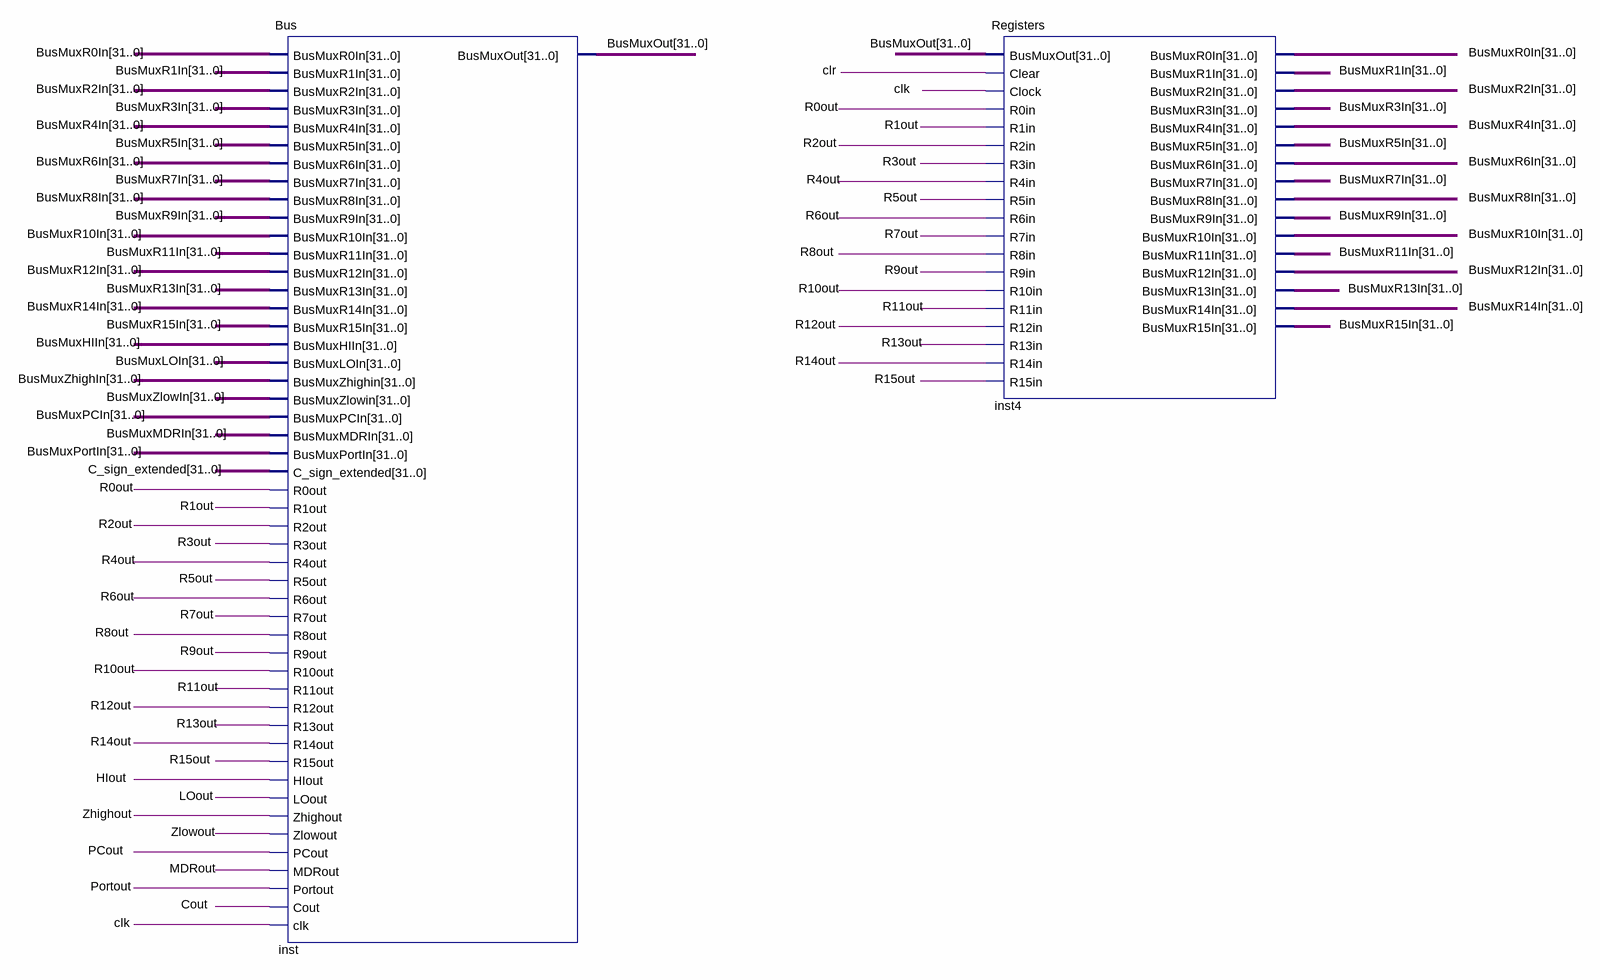
[diagram p0: schematic sheet]
// Quartus schematic CpuDesign.bdf as structural Verilog: 2 symbols, 0 pins
module CpuDesign (
);

  wire clk, clr, Cout, HIout, LOout, MDRout, PCout, Portout, R0out, R1out, R2out, R3out, R4out, R5out, R6out,
       R7out, R8out, R9out, R10out, R11out, R12out, R13out, R14out, R15out, Zhighout, Zlowout;
  wire [31:0] BusMuxHIIn, BusMuxLOIn, BusMuxMDRIn, BusMuxOut, BusMuxPCIn, BusMuxPortIn, BusMuxR0In,
       BusMuxR1In, BusMuxR2In, BusMuxR3In, BusMuxR4In, BusMuxR5In, BusMuxR6In, BusMuxR7In, BusMuxR8In,
       BusMuxR9In, BusMuxR10In, BusMuxR11In, BusMuxR12In, BusMuxR13In, BusMuxR14In, BusMuxR15In,
       BusMuxZhighIn, BusMuxZlowIn, C_sign_extended;

  Bus inst (
    .BusMuxR0In(BusMuxR0In), .BusMuxR1In(BusMuxR1In), .BusMuxR2In(BusMuxR2In), .BusMuxR3In(BusMuxR3In),
    .BusMuxR4In(BusMuxR4In), .BusMuxR5In(BusMuxR5In), .BusMuxR6In(BusMuxR6In), .BusMuxR7In(BusMuxR7In),
    .BusMuxR8In(BusMuxR8In), .BusMuxR9In(BusMuxR9In), .BusMuxR10In(BusMuxR10In), .BusMuxR11In(BusMuxR11In),
    .BusMuxR12In(BusMuxR12In), .BusMuxR13In(BusMuxR13In), .BusMuxR14In(BusMuxR14In),
    .BusMuxR15In(BusMuxR15In), .BusMuxHIIn(BusMuxHIIn), .BusMuxLOIn(BusMuxLOIn),
    .BusMuxZhighin(BusMuxZhighIn), .BusMuxZlowin(BusMuxZlowIn), .BusMuxPCIn(BusMuxPCIn),
    .BusMuxMDRIn(BusMuxMDRIn), .BusMuxPortIn(BusMuxPortIn), .C_sign_extended(C_sign_extended), .R0out(R0out),
    .R1out(R1out), .R2out(R2out), .R3out(R3out), .R4out(R4out), .R5out(R5out), .R6out(R6out), .R7out(R7out),
    .R8out(R8out), .R9out(R9out), .R10out(R10out), .R11out(R11out), .R12out(R12out), .R13out(R13out),
    .R14out(R14out), .R15out(R15out), .HIout(HIout), .LOout(LOout), .Zhighout(Zhighout), .Zlowout(Zlowout),
    .PCout(PCout), .MDRout(MDRout), .Portout(Portout), .Cout(Cout), .clk(clk), .BusMuxOut(BusMuxOut));
  Registers inst4 (
    .BusMuxOut(BusMuxOut), .Clear(clr), .Clock(clk), .R0in(R0out), .R1in(R1out), .R2in(R2out), .R3in(R3out),
    .R4in(R4out), .R5in(R5out), .R6in(R6out), .R7in(R7out), .R8in(R8out), .R9in(R9out), .R10in(R10out),
    .R11in(R11out), .R12in(R12out), .R13in(R13out), .R14in(R14out), .R15in(R15out), .BusMuxR0In(BusMuxR0In),
    .BusMuxR1In(BusMuxR1In), .BusMuxR2In(BusMuxR2In), .BusMuxR3In(BusMuxR3In), .BusMuxR4In(BusMuxR4In),
    .BusMuxR5In(BusMuxR5In), .BusMuxR6In(BusMuxR6In), .BusMuxR7In(BusMuxR7In), .BusMuxR8In(BusMuxR8In),
    .BusMuxR9In(BusMuxR9In), .BusMuxR10In(BusMuxR10In), .BusMuxR11In(BusMuxR11In), .BusMuxR12In(BusMuxR12In),
    .BusMuxR13In(BusMuxR13In), .BusMuxR14In(BusMuxR14In), .BusMuxR15In(BusMuxR15In));
endmodule
